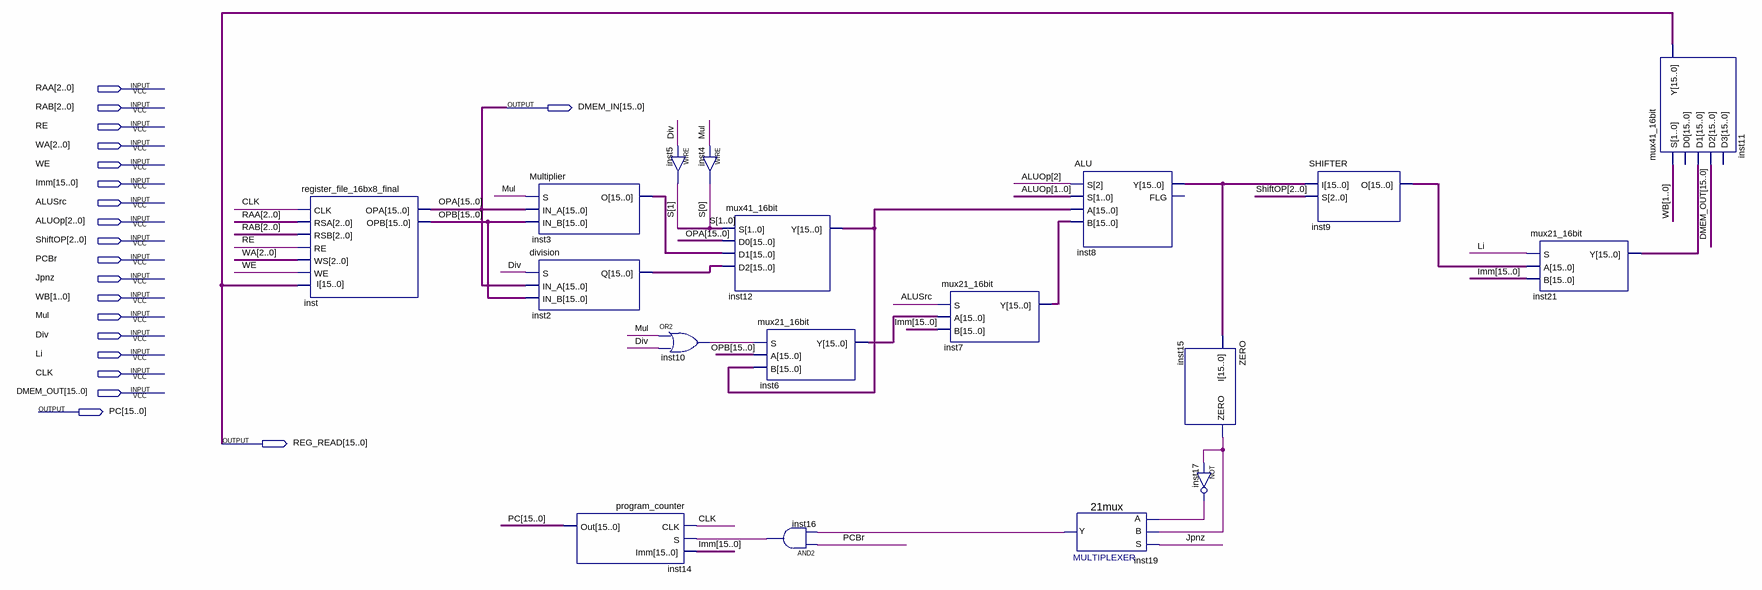
[diagram p0: schematic sheet]
// Quartus schematic DatapathCPU.bdf as structural Verilog: 18 symbols, 20 pins
module DatapathCPU (
  input  [2:0] RAA,
  input  [2:0] RAB,
  input  RE,
  input  [2:0] WA,
  input  WE,
  input  [15:0] Imm,
  input  ALUSrc,
  input  [2:0] ALUOp,
  input  [2:0] ShiftOP,
  input  PCBr,
  input  Jpnz,
  input  [1:0] WB,
  input  Mul,
  input  Div,
  input  Li,
  input  CLK,
  input  [15:0] DMEM_OUT,
  output [15:0] DMEM_IN,
  output [15:0] PC,
  output [15:0] REG_READ
);

  wire inst10_out, inst15_zero, inst16_out, inst17_out, inst19_y;
  wire [1:0] S;
  wire [15:0] inst2_q, inst3_o, inst6_y, inst7_y, inst8_y, inst9_o, inst12_y, inst21_y, OPB;

  register_file_16bx8_final inst (
    .CLK(CLK), .RSA(RAA), .RSB(RAB), .RE(RE), .WS(WA), .I(REG_READ), .WE(WE), .OPA(DMEM_IN), .OPB(OPB));
  Multiplier inst3 (.S(Mul), .IN_A(DMEM_IN), .IN_B(OPB), .O(inst3_o));
  division inst2 (.S(Div), .IN_A(DMEM_IN), .IN_B(OPB), .Q(inst2_q));
  program_counter inst14 (.CLK(CLK), .S(inst16_out), .Imm(Imm), .Out(PC));
  assign S[1] = Div;  // WIRE inst5
  or inst10 (inst10_out, Mul, Div);
  assign S[0] = Mul;  // WIRE inst4
  mux41_16bit inst12 (.D0(DMEM_IN), .D1(inst3_o), .D2(inst2_q), .S(S), .Y(inst12_y));
  mux21_16bit inst6 (.S(inst10_out), .A(OPB), .B(inst12_y), .Y(inst6_y));
  and inst16 (inst16_out, PCBr, inst19_y);
  mux21_16bit inst7 (.S(ALUSrc), .A(inst6_y), .B(Imm), .Y(inst7_y));
  ALU inst8 (.S(ALUOp), .A(inst12_y), .B(inst7_y), .Y(inst8_y));  // open: FLG
  \21mux  inst19 (.S(Jpnz), .B(inst15_zero), .A(inst17_out), .Y(inst19_y));
  ZERO inst15 (.I(inst8_y), .ZERO(inst15_zero));
  not inst17 (inst17_out, inst15_zero);
  SHIFTER inst9 (.I(inst8_y), .S(ShiftOP), .O(inst9_o));
  mux21_16bit inst21 (.S(Li), .A(inst9_o), .B(Imm), .Y(inst21_y));
  mux41_16bit inst11 (.D1(inst21_y), .D2(DMEM_OUT), .S(WB), .Y(REG_READ));  // open: D0, D3

  // Other names for the same wires on the sheet: OPA[15:0] = DMEM_IN
endmodule
